# EAGLE design MotorDriver2_v0.6 (EAGLE 5.10)
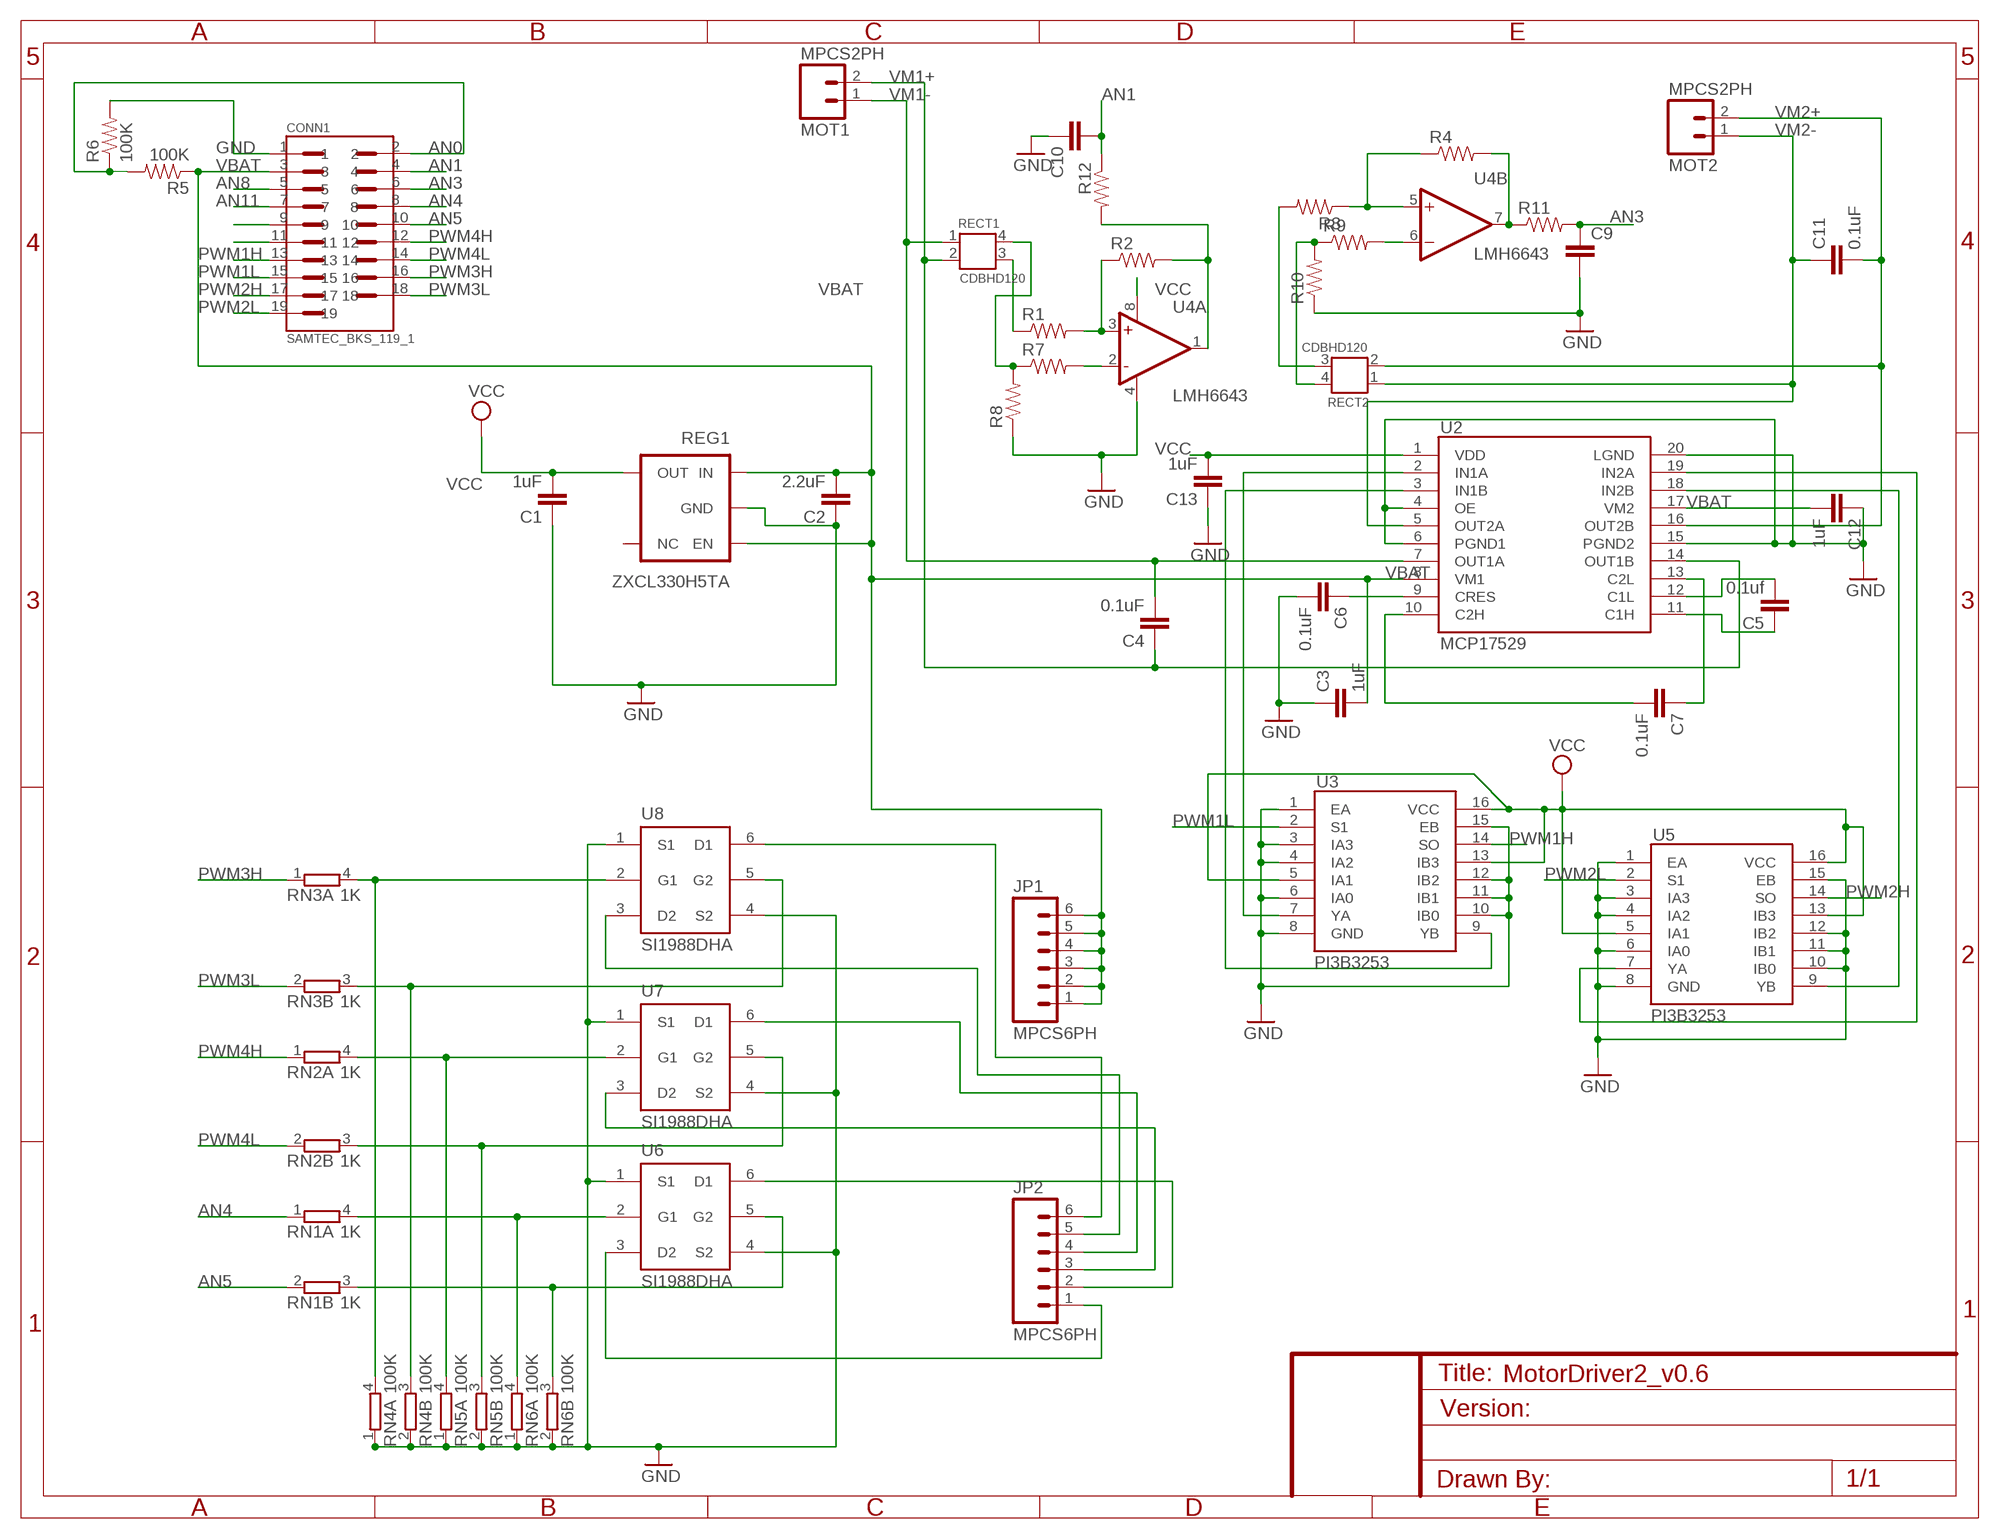
[diagram p0: schematic, sheet 1]

## Parts
C1  1uF  CAP0402-CAP  [0402-CAP]
C2  2.2uF  CAP0402-CAP  [0402-CAP]
C3  1uF  CAP0402-CAP  [0402-CAP]
C4  0.1uF  CAP0402-CAP  [0402-CAP]
C5  0.1uf  CAP0402-CAP  [0402-CAP]
C6  0.1uF  CAP0402-CAP  [0402-CAP]
C7  0.1uF  CAP0402-CAP  [0402-CAP]
C9  CAP0402-CAP  [0402-CAP]
C10  CAP0402-CAP  [0402-CAP]
C11  0.1uF  CAP0402-CAP  [0402-CAP]
C12  1uF  CAP0402-CAP  [0402-CAP]
C13  1uF  CAP0402-CAP  [0402-CAP]
CONN1  SAMTEC_BKS_119_1  [SAMTEC_19P_1MM_SOCKET]
JP1  MPCS6PH  [MOLEX-PICO_CLASP_S6P]
JP2  MPCS6PH  [MOLEX-PICO_CLASP_S6P]
MOT1  MPCS2PH  [MOLEX-PICO_CLASP_S2P]
MOT2  MPCS2PH  [MOLEX-PICO_CLASP_S2P]
R1  RESISTOR0402-RES  [0402-RES]
R2  RESISTOR0402-RES  [0402-RES]
R3  RESISTOR0402-RES  [0402-RES]
R4  RESISTOR0402-RES  [0402-RES]
R5  100K  RESISTOR0402-RES  [0402-RES]
R6  100K  RESISTOR0402-RES  [0402-RES]
R7  RESISTOR0402-RES  [0402-RES]
R8  RESISTOR0402-RES  [0402-RES]
R9  RESISTOR0402-RES  [0402-RES]
R10  RESISTOR0402-RES  [0402-RES]
R11  RESISTOR0402-RES  [0402-RES]
R12  RESISTOR0402-RES  [0402-RES]
RECT1  CDBHD120  [4-PIN_TO-269AA]
RECT2  CDBHD120  [4-PIN_TO-269AA]
REG1  ZXCL330H5TA  [SC-70-5]
RN1  1K  2R-NEXB24V  [EXB24V]
RN2  1K  2R-NEXB24V  [EXB24V]
RN3  1K  2R-NEXB24V  [EXB24V]
RN4  100K  2R-NEXB24V  [EXB24V]
RN5  100K  2R-NEXB24V  [EXB24V]
RN6  100K  2R-NEXB24V  [EXB24V]
U2  MCP17529  [20-T_VMFP]
U3  PI3B3253  [16-PIN_QSOP]
U4  LMH6643  [8-PIN_MSOP]
U5  PI3B3253  [16-PIN_QSOP]
U6  SI1988DHA  [SC-70-6]
U7  SI1988DHA  [SC-70-6]
U8  SI1988DHA  [SC-70-6]

## Nets
AN0 [Signal]: CONN1.2 R5.2 R6.1
AN1 [Signal]: C10.2 CONN1.4 R12.1
AN3 [Signal]: C9.1 CONN1.6 R11.2
AN4 [Signal]: CONN1.8 RN1.1
AN5 [Signal]: CONN1.10 RN1.2
AN8 [Signal]: CONN1.5
AN11 [Signal]: CONN1.7
GND [GND]: C1.1 C2.1 C3.1 C6.2 C9.2 C10.1 C12.1 C13.1 CONN1.1 R6.2 R8.1 R10.1 REG1.2(GND) RN4.1 RN4.2 RN5.1 RN5.2 RN6.1 RN6.2 U2.4(OE) U2.6(PGND1) U2.15(PGND2) U2.20(LGND) U3.1(EA) U3.3(IA3) U3.4(IA2) U3.6(IA0) U3.8(GND) U3.10(IB0) U3.11(IB1) U3.12(IB2) U3.15(EB) U4.4(A:VCC-) U5.1(EA) U5.3(IA3) U5.4(IA2) U5.6(IA0) U5.8(GND) U5.10(IB0) U5.11(IB1) U5.12(IB2) U5.15(EB) U6.1(S1) U6.4(S2) U7.1(S1) U7.4(S2) U8.1(S1) U8.4(S2)
N$3 [Signal]: U2.2(IN1A) U3.7(YA)
N$4 [Signal]: U2.3(IN1B) U3.9(YB)
N$5 [Signal]: C5.2 U2.12(C1L)
N$6 [Signal]: C5.1 U2.11(C1H)
N$7 [Signal]: R3.2 RECT2.3
N$8 [Signal]: C7.1 U2.13(C2L)
N$10 [Signal]: C7.2 U2.10(C2H)
N$11 [Signal]: C6.1 U2.9(CRES)
N$12 [Signal]: R1.2 R2.1 U4.3(A:+IN)
N$13 [Signal]: R2.2 R12.2 U4.1(A:OUT)
N$14 [Signal]: R3.1 R4.1 U4.5(B:+IN)
N$15 [Signal]: U2.19(IN2A) U5.7(YA)
N$16 [Signal]: U2.18(IN2B) U5.9(YB)
N$17 [Signal]: R4.2 R11.1 U4.7(B:OUT)
N$18 [Signal]: R9.1 R9.2 R10.2 RECT2.4 U4.6(B:-IN)
N$19 [Signal]: R7.2 U4.2(A:-IN)
N$21 [Signal]: JP2.6 U8.6(D1)
N$22 [Signal]: JP2.5 U8.3(D2)
N$23 [Signal]: JP2.4 U7.6(D1)
N$24 [Signal]: JP2.3 U7.3(D2)
N$25 [Signal]: JP2.2 U6.6(D1)
N$26 [Signal]: JP2.1 U6.3(D2)
N$27 [Signal]: RN1.3 RN6.3 U6.5(G2)
N$28 [Signal]: RN1.4 RN6.4 U6.2(G1)
N$29 [Signal]: RN2.3 RN5.3 U7.5(G2)
N$30 [Signal]: RN2.4 RN5.4 U7.2(G1)
N$31 [Signal]: R1.1 RECT1.3
N$32 [Signal]: RN3.4 RN4.4 U8.2(G1)
N$33 [Signal]: R7.1 R8.2 RECT1.4
N$50 [Signal]: RN3.3 RN4.3 U8.5(G2)
P9 [Signal]: CONN1.9
P11 [Signal]: CONN1.11
PWM1H [Signal]: CONN1.13 U3.14(SO)
PWM1L [Signal]: CONN1.15 U3.2(S1)
PWM2H [Signal]: CONN1.17 U5.14(SO)
PWM2L [Signal]: CONN1.19 U5.2(S1)
PWM3H [Signal]: CONN1.16 RN3.1
PWM3L [Signal]: CONN1.18 RN3.2
PWM4H [Signal]: CONN1.12 RN2.1
PWM4L [Signal]: CONN1.14 RN2.2
VBAT: C2.2 C3.2 C12.2 CONN1.3 JP1.1 JP1.2 JP1.3 JP1.4 JP1.5 JP1.6 R5.1 REG1.1(IN) REG1.3(EN) U2.8(VM1) U2.17(VM2)
VCC [VCC]: C1.2 C13.2 REG1.5(OUT) U2.1(VDD) U3.5(IA1) U3.13(IB3) U3.16(VCC) U4.8(A:VCC+) U5.5(IA1) U5.13(IB3) U5.16(VCC)
VM1+: C4.1 MOT1.2 RECT1.2 U2.14(OUT1B)
VM1-: C4.2 MOT1.1 RECT1.1 U2.7(OUT1A)
VM2+: C11.2 MOT2.2 RECT2.2 U2.16(OUT2B)
VM2-: C11.1 MOT2.1 RECT2.1 U2.5(OUT2A)
Unconnected: REG1.4(NC)

## Library data of the parts
C1-C7 C9-C13 = SparkFun:CAP: Capacitor Standard 0603 ceramic capacitor, and 0.1" leaded capacitor.
CONN1 = AMH:SAMTEC_BKS_119_1
JP1 JP2 = stan:MPCS6P: Molex Pico-Clasp Single Row 6 Pos
MOT1 MOT2 = stan:MPCS2P: Molex Pico-Clasp Single Row 2 POS
R1-R12 = SparkFun:RESISTOR: Resistor Basic schematic elements and footprints for 0603, 1206, and PTH 1/10th watt (small) resistors.
RECT1 RECT2 = AMH:CDBHD120
REG1 = stan:ZXCL330: Zetex ZXCL Series Voltage Regulator
RN1-RN6 = resistor-dil:2R-N: Array Chip Resistor Source: Panasonic
U2 = AMH:MCP17529
U3 U5 = AMH:PI3B3253
U4 = AMH:LMH6643
U6-U8 = stan:SI1988DH: 2 N-Channel MOSFET Package: SC-70-6

## Net classes
0 Power: width 0.305 mm, drill 0.254 mm, clearance 0.152 mm
1 Signal: width 0.152 mm, drill 0.254 mm, clearance 0.152 mm
2 GND: width 0.305 mm, drill 0.254 mm, clearance 0.152 mm
3 VCC: width 0.254 mm, drill 0.254 mm, clearance 0.152 mm

## Board
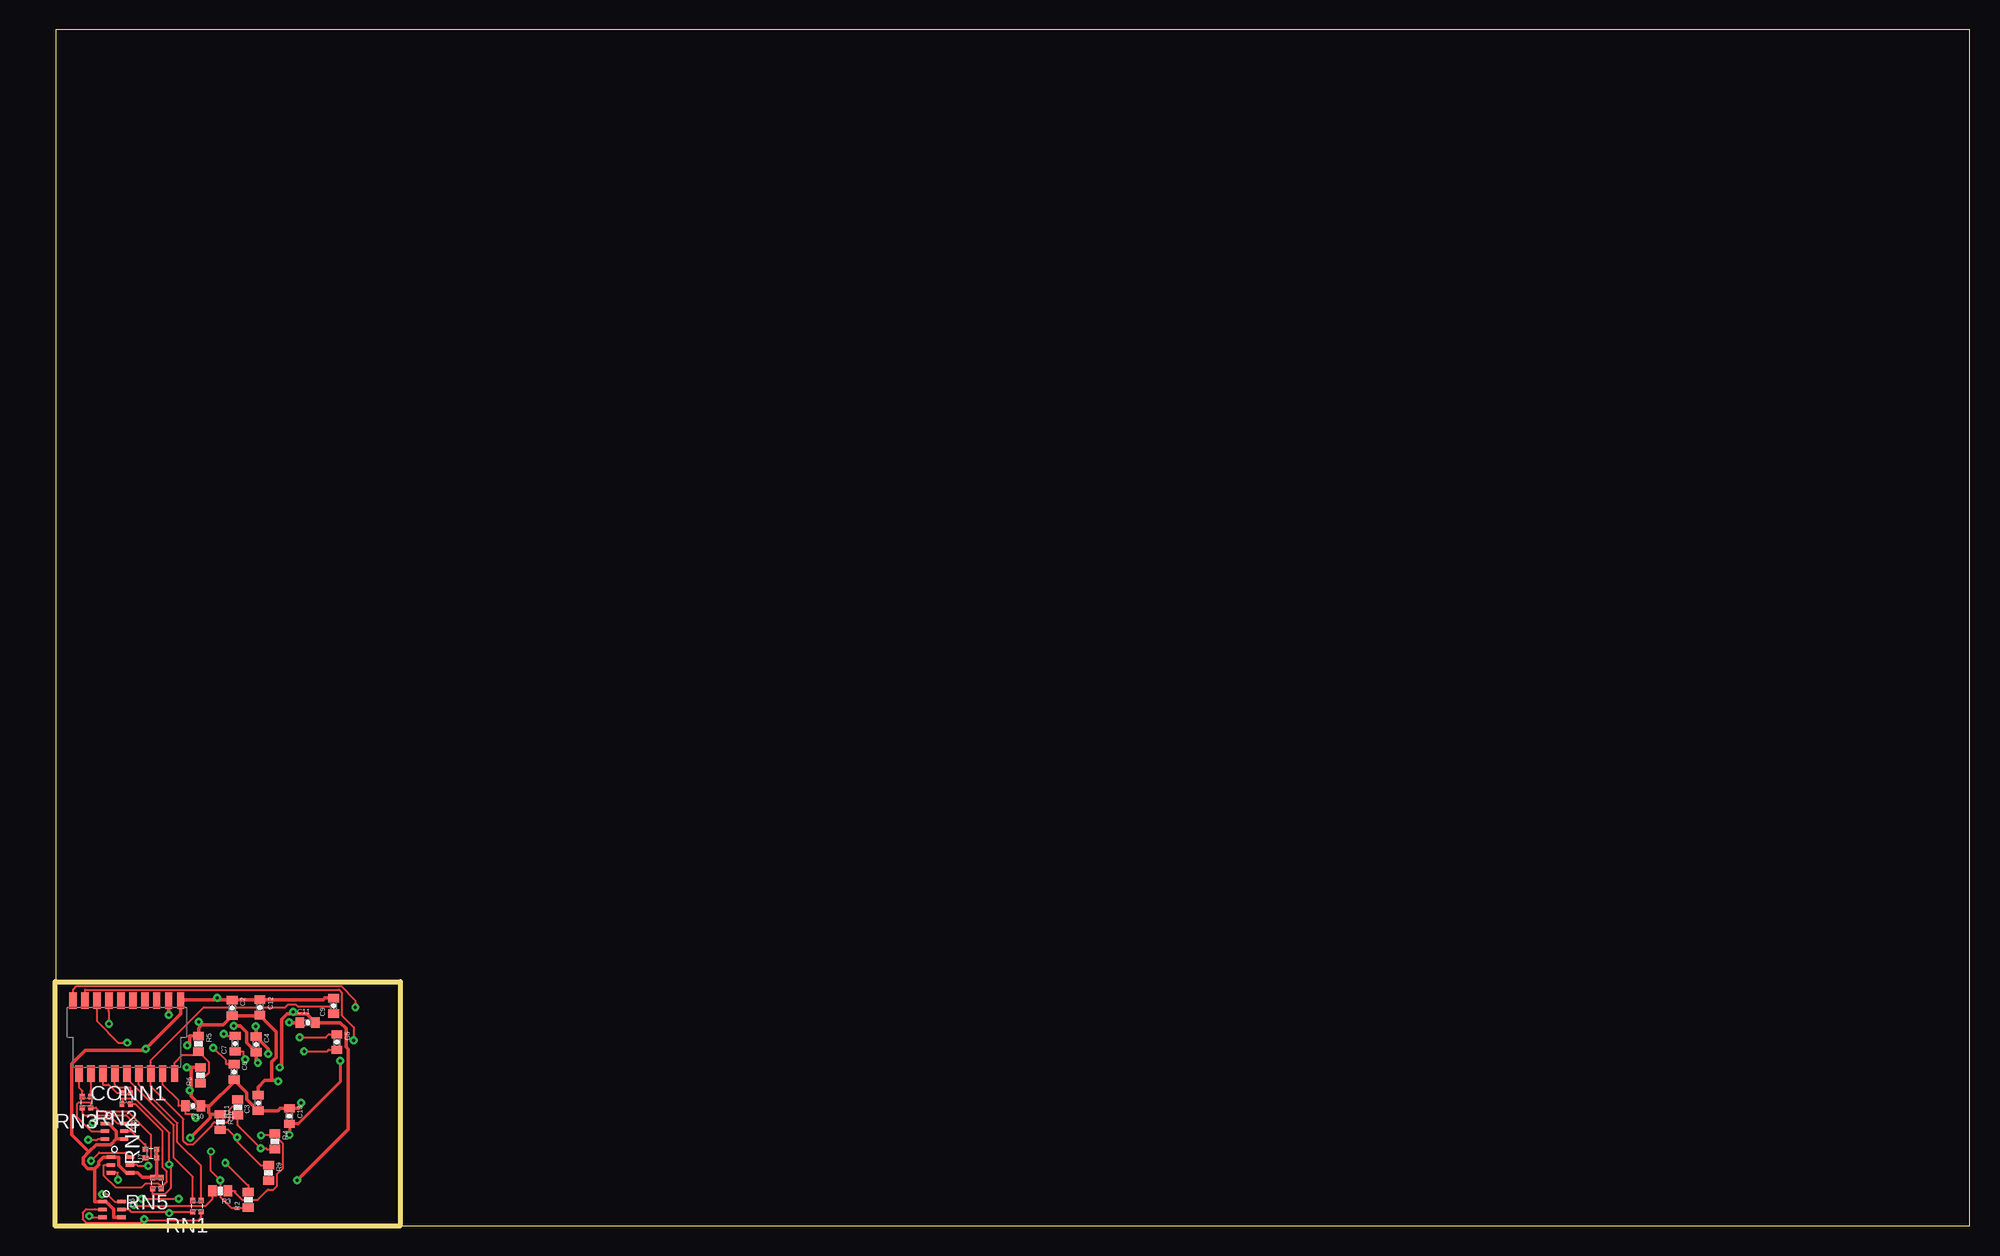
[diagram p1: board, top side]
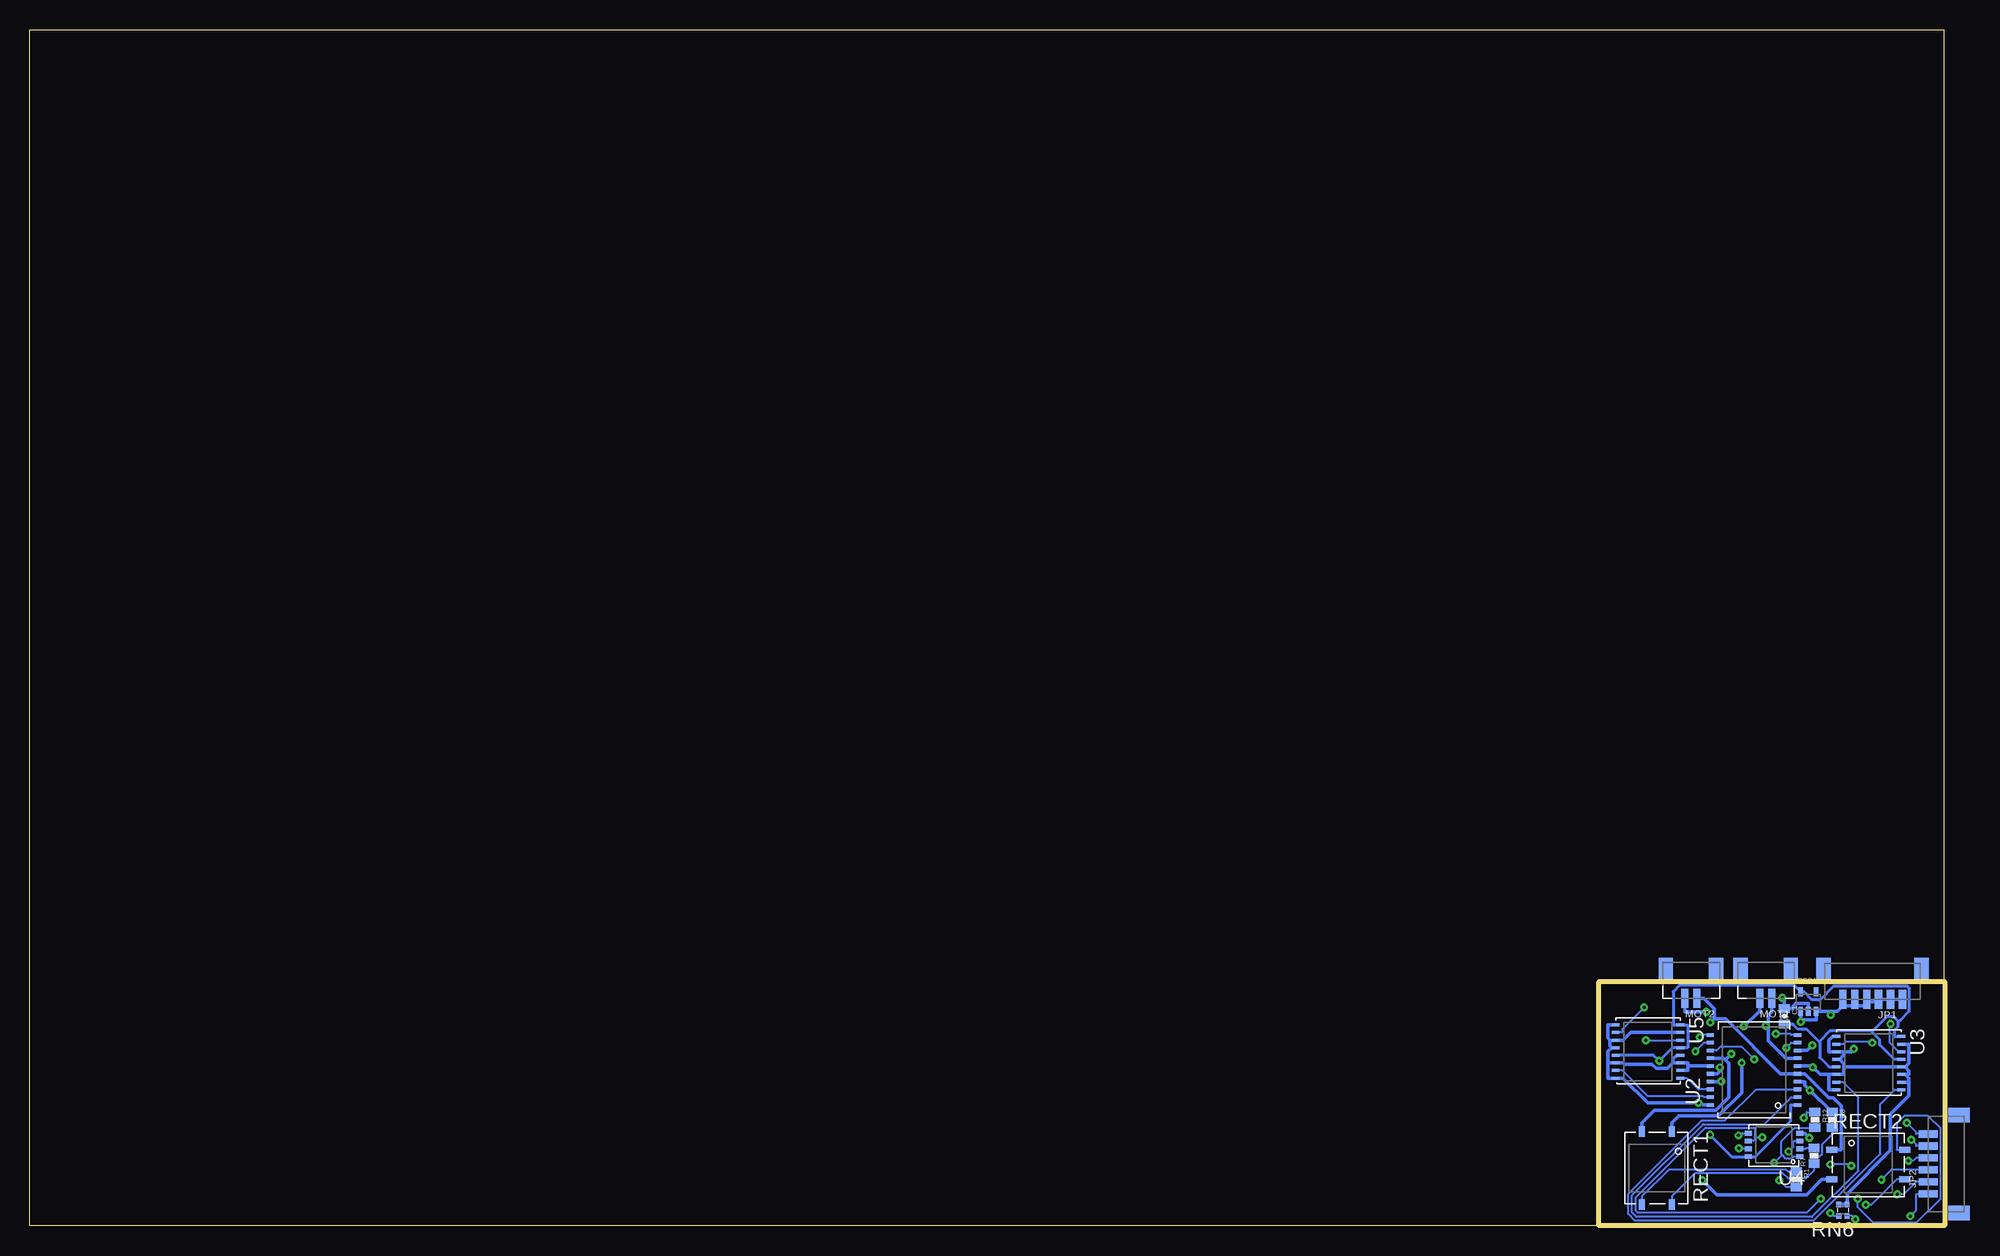
[diagram p2: board, bottom side, seen from below]

Size 160.1 x 100 mm. Coordinates in mm from the lower left corner, seen from the top.
Outline: 28.9,0 0.1,0 0.1,20.4
Outline: 28.9,0 160.1,0 160.1,100 0.1,100 0.1,20.4
Outline: 0.1,20.4 28.9,20.4 28.9,0
Outline: 0.1,20.4 0,20.4 0,0 28.9,0
Copper layers (1*16): Top 0.035mm / dielectric 1.5mm / Bottom 0.035mm
Design rules "default *": minimum track width 6mil, minimum drill 10mil, track to track 6mil, track to pad 6mil, pad to pad 6mil, via to via 6mil, smd to smd 6mil, copper to edge 0mil, drill to drill 6mil, minimum pad ring 10mil, minimum via ring 8mil, stop-mask expansion 4mil, vias tented up to drill 0mil, thermal gap 10mil

### Footprints (pad centres in the part's own frame; a part is rotated, then mirrored left to right if it is on the bottom)
0402-CAP = smd 0.7 x 0.9: 1 -0.65,0; 2 0.65,0
SAMTEC_19P_1MM_SOCKET = smd 0.61 x 1.375: 1 -4,-3.05; 2 -3.5,3.05; 3 -3,-3.05; 4 -2.5,3.05; 5 -2,-3.05; 6 -1.5,3.05; 7 -1,-3.05; 8 -0.5,3.05; 9 0,-3.05; 10 0.5,3.05; 11 1,-3.05; 12 1.5,3.05; 13 2,-3.05; 14 2.5,3.05; 15 3,-3.05; 16 3.5,3.05; 17 4,-3.05; 18 4.5,3.05; 19 5,-3.05
MOLEX-PICO_CLASP_S6P = smd 0.6 x 1.6: 1 -2.5,1; 2 -1.5,1; 3 -0.5,1; 4 0.5,1; 5 1.5,1; 6 2.5,1 | smd 1.2 x 1.8: A -4.1,-1.55; B 4.1,-1.55
MOLEX-PICO_CLASP_S2P = smd 0.6 x 1.6: 1 -0.5,1; 2 0.5,1 | smd 1.2 x 1.8: A -2.1,-1.5; B 2.1,-1.5
0402-RES = smd 0.7 x 0.9: 1 -0.65,0; 2 0.65,0
4-PIN_TO-269AA = smd 0.9 x 0.5: 1 -3.05,1.25; 2 -3.05,-1.25; 3 3.05,-1.25; 4 3.05,1.25
SC-70-5 = smd 0.4 x 0.75: 1 -0.65,-0.825; 2 0,-0.825; 3 0.65,-0.825; 4 0.65,0.825; 5 -0.65,0.825
EXB24V = smd 0.4 x 0.45: 1 -0.35,-0.475; 2 0.35,-0.475; 3 0.35,0.475; 4 -0.35,0.475
20-T_VMFP = smd 0.3 x 0.6: 1 -2.925,-3.65; 2 -2.275,-3.65; 3 -1.625,-3.65; 4 -0.975,-3.65; 5 -0.325,-3.65; 6 0.325,-3.65; 7 0.975,-3.65; 8 1.625,-3.65; 9 2.275,-3.65; 10 2.925,-3.65; 11 2.925,3.65; 12 2.275,3.65; 13 1.625,3.65; 14 0.975,3.65; 15 0.325,3.65; 16 -0.325,3.65; 17 -0.975,3.65; 18 -1.625,3.65; 19 -2.275,3.65; 20 -2.925,3.65
16-PIN_QSOP = smd 0.25 x 0.65: 1 -2.223,-2.715; 2 -1.587,-2.715; 3 -0.953,-2.715; 4 -0.318,-2.715; 5 0.318,-2.715; 6 0.953,-2.715; 7 1.587,-2.715; 8 2.223,-2.715; 9 2.223,2.715; 10 1.587,2.715; 11 0.953,2.715; 12 0.318,2.715; 13 -0.318,2.715; 14 -0.953,2.715; 15 -1.587,2.715; 16 -2.223,2.715
8-PIN_MSOP = smd 0.6 x 0.41: 1 -2.15,0.975; 2 -2.15,0.325; 3 -2.15,-0.325; 4 -2.15,-0.975; 5 2.15,-0.975; 6 2.15,-0.325; 7 2.15,0.325; 8 2.15,0.975
SC-70-6 = smd 0.3 x 0.7: 1 -0.65,-0.8; 2 0,-0.8; 3 0.65,-0.8; 4 0.65,0.8; 5 0,0.8; 6 -0.65,0.8

### Placement (x,y rotation side)
C1  13.42,17.51 270 bottom
C2  14.84,18.22 270 top
C3  17,10.27 90 top
C4  16.84,15.16 270 top
C5  23.59,15.36 270 top
C6  15,12.86 270 top
C7  15.08,15.23 90 top
C9  23.32,18.4 90 top
C10  11.57,10.02 180 top
C11  21.15,16.98 0 top
C12  17.16,18.26 270 top
C13  19.62,9.17 270 top
CONN1  6.53,15.77 180 top
JP1  6.03,19.93 180 bottom
JP2  0.37,5.17 90 bottom
MOT1  14.97,20.01 180 bottom
MOT2  21.22,20.01 180 bottom
R1  12.42,3.88 270 bottom
R2  16.18,2.17 90 top
R3  13.84,2.92 180 top
R4  18.4,7.05 270 top
R5  12.02,15.22 270 top
R6  12.18,12.59 90 top
R7  10.92,5.86 90 bottom
R8  9.4,8.87 270 bottom
R9  17.88,4.42 270 top
R10  13.84,8.67 270 top
R11  15.3,9.9 90 top
R12  10.86,8.85 270 bottom
RECT1  24.06,4.82 270 bottom
RECT2  6.39,5.12 0 bottom
REG1  11.4,18.74 0 bottom
RN1  11.89,1.64 180 top
RN2  5.97,10.64 180 top
RN3  2.65,10.34 180 top
RN4  8.05,6.04 90 top
RN5  8.54,3.57 180 top
RN6  8.51,1.3 180 bottom
U2  15.95,13.03 90 bottom
U3  6.34,13.6 270 bottom
U4  14.28,6.76 180 bottom
U5  24.81,14.57 270 bottom
U6  4.79,1.36 270 top
U7  5.49,5.08 270 top
U8  5.01,7.91 270 top

### Tracks (layer width: path | path; a pad name or v marks a point on that pad's centre or on a via)
AN0
  Top 0.152: R6.1 12.18,12.52 12.61,12.52 12.86,12.76 12.86,13.73 12.3,14.28 12.02,14.28 | CONN1.2 10.03,13.64 10.67,14.28 12.02,14.28 | 12.02,14.28 R5.2
AN1  (via drill 0.25 pad 0.66)
  Top 0.152: v11.8,9.03 11.49,9.34 10.92,9.34 C10.2 10.34,10.02 10.34,10.49 9.03,11.8 CONN1.4
  Bottom 0.152: v11.8,9.03 11.54,9.29 11.54,9.5 R12.1
AN3
  Top 0.152: R11.2 15.3,9.97 14.87,9.97 14.62,9.73 14.62,8.88 14.4,8.67 13.35,8.67 13.16,8.48 13.16,8.39 11.56,6.79 11.06,6.79 10.75,7.1 10.75,8.92 8.03,11.64 CONN1.6 8.03,13.64 8.03,13.85 12.45,18.27 19.27,18.27 19.5,18.5 20.15,18.5 20.32,18.33 23.32,18.33 C9.1
AN4
  Top 0.152: RN1.1 12.24,2.57 12.24,5.01 10.26,7 10.26,8.58 7.03,11.8 CONN1.8
AN5
  Top 0.152: RN1.2 11.54,4.09 9.95,5.68 9.95,8.42 6.03,12.34 CONN1.10
GND  (via drill 0.25 pad 0.66)
  Top 0.305: 11.42,11.33 11.42,10.81 C10.1 12.88,10.02 | 11.42,13.24 11.42,11.33 | 11.42,11.33 v11.27,11.33 | 2.85,6.16 1.42,7.59 1.42,13.54 2.56,14.68 7.47,14.68 v7.59,14.79 10.53,17.73 CONN1.1 10.58,18.87 13.58,18.87 | 2.85,6.16 3.47,6.78 4.68,6.78 5.15,7.26 | 3.33,4.77 2.77,4.77 2.36,5.18 2.36,5.67 2.85,6.16 | 12.98,9.32 12.98,9.02 v11.31,7.36 | 12.88,10.02 12.88,9.43 12.98,9.32 | 12.98,9.32 13.08,9.32 R10.1 | 3.33,4.77 3.67,5.1 3.67,5.36 4.04,5.73 U7.1 5.34,5.73 5.34,5.06 5.97,4.43 U7.4 6.94,4.43 7.33,4.04 RN5.2 8.53,4.04 | 3.33,4.77 3.33,2.01 U6.1 4.29,2.01 4.93,1.37 4.93,0.71 U6.4 | 13.58,18.87 v13.58,19.06 | 13.58,18.87 C2.1 15.59,18.87 15.63,18.91 C12.1 17.92,18.91 22.43,18.91 22.57,19.05 C9.2 | v11.02,13.26 11.4,13.26 11.42,13.24 | RN4.2 RN4.1 8.53,5.18 8.53,4.04 | 15,12.05 15.11,12.05 16.05,11.1 16.05,10.56 C3.1 17.76,9.62 18.67,9.62 18.87,9.82 19.43,9.82 C13.1 20.38,9.82 20.6,10.04 v20.6,10.28 | 12.88,10.02 12.97,10.02 15,12.05 | 11.42,13.24 R6.2 | 5.15,7.26 U8.4 | 5.15,7.26 5.15,7.9 4.49,8.56 U8.1 | 15,12.05 C6.2 | 8.53,4.04 RN5.1
  Bottom 0.305: 9.69,12.65 9.69,11.38 U3.8 | 9.69,12.65 10.4,12.65 v11.02,13.26 11.11,13.36 11.7,13.36 U2.6 | R8.1 9.46,9.52 v11.27,11.33 11.7,11.76 11.7,12.05 U2.4 | 8.42,14.55 7.83,14.55 v7.59,14.79 | 8.79,13.92 8.42,14.28 8.42,14.55 | v11.31,7.36 11.69,7.74 U4.4 | 3,12.01 3,10.87 4.54,9.33 4.54,6.31 8.16,2.69 8.16,2.04 | 3.31,12.65 3,12.33 3,12.01 | 3.31,13.28 3,13.6 3,15.19 U3.15 | 3.31,13.28 3,12.97 3,12.65 3.31,12.65 | 8.42,14.55 U3.3 9.69,14.55 9.69,15.51 9.37,15.82 U3.1 | v13.58,19.06 13.58,18.97 13.42,18.82 C1.1 12.66,18.16 12.66,18.38 12.45,18.59 11.4,18.59 REG1.2 | 3,12.01 U3.10 | 3.31,12.65 U3.11 | 3.31,13.28 U3.12 4.25,13.28 8.42,13.28 | 8.42,13.28 8.42,13.55 8.79,13.92 | 8.42,13.28 8.42,12.65 U3.6 9.23,12.65 9.69,12.65 | 8.79,13.92 U3.4 | 22.73,13.62 23.2,13.14 24.13,13.14 24.51,13.52 | 24.51,13.52 | 24.51,13.52 26.79,13.52 26.9,13.62 U5.6 28.16,13.62 | 22.73,13.62 22.73,13.94 22.41,14.25 U5.12 | 22.73,13.62 U5.11 21.46,13.62 21.46,13.36 | 27.84,14.89 28.16,14.57 28.16,13.62 | 28.16,13.62 28.16,12.35 U5.8 26.9,12.35 24.83,10.28 v20.6,10.28 20.38,10.28 20.21,10.11 U2.20 | 21.46,13.36 21.46,12.98 U5.10 | 21.46,13.36 20.21,13.36 U2.15 | U5.15 22.3,16.16 22.73,16.16 26.26,16.16 26.9,15.52 U5.3 27.98,15.52 | 27.84,14.89 27.98,15.03 27.98,15.52 | U5.1 28.16,16.79 28.16,15.69 27.98,15.52 | RN6.2 8.36,1.77 8.36,1.84 8.16,2.04 | 8.16,2.04 RN6.1 | 27.84,14.89 U5.4
N$3
  Bottom 0.152: U3.7 8.5,12.01 7.22,10.73 7.22,4.61 11.09,0.74 25.78,0.74 26.16,1.12 26.16,2.53 20.19,8.5 15.08,8.5 12.83,10.76 U2.2
N$4
  Bottom 0.152: U2.3 15.77,11.4 18.37,8.8 20.32,8.8 26.46,2.66 26.46,0.99 25.91,0.43 10.97,0.43 | 10.97,0.43 | 5.39,6.02 10.97,0.43 | 5.39,6.02 | 5.39,6.02 5.39,10.17 4.18,11.38 U3.9
N$5  (via drill 0.25 pad 0.66)
  Top 0.152: C5.2 22.91,14.71 22.8,14.6 v20.84,14.6
  Bottom 0.152: U2.12 20.13,15.3 v20.84,14.6
N$6  (via drill 0.25 pad 0.66)
  Top 0.152: C5.1 22.91,16.01 22.66,15.75 v20.49,15.75
  Bottom 0.152: U2.11 20.29,15.96 v20.49,15.75
N$7  (via drill 0.25 pad 0.66)
  Top 0.152: v6.6,1.74 6.69,1.65 12.6,1.65 13.19,2.24 R3.2
  Bottom 0.152: v6.6,1.74 6.15,1.74 4.02,3.87 RECT2.3
N$8  (via drill 0.25 pad 0.66)
  Top 0.152: v15.93,13.91 15.76,14.09 15.76,14.58 C7.1
  Bottom 0.152: U2.13 19.07,14.65 18.77,14.95 16.98,14.95 v15.93,13.91
N$10  (via drill 0.25 pad 0.66)
  Top 0.152: C7.2 14.4,15.88 14.23,16.05 v14.11,16.05
  Bottom 0.152: U2.10 12.83,15.96 12.92,16.05 v14.11,16.05
N$11  (via drill 0.25 pad 0.66)
  Top 0.152: v13.26,14.87 14.32,13.81 14.32,13.51 C6.1
  Bottom 0.152: v13.26,14.87 12.83,15.3 U2.9
N$12  (via drill 0.25 pad 0.66)
  Top 0.152: v13.06,6.2 13.06,4.59 v13.84,3.81 13.84,2.42 14.74,1.52 R2.1
  Bottom 0.152: v13.06,6.2 12.66,6.6 12.66,7.08 U4.3 | v13.84,3.81 13.25,3.23 R1.2
N$13  (via drill 0.25 pad 0.66)
  Top 0.152: v14.27,5.25 16.12,3.4 16.18,3.4 R2.2
  Bottom 0.152: 13.59,5.93 v14.27,5.25 | 13.59,5.93 13.29,5.62 12.83,5.62 12.66,5.79 U4.1 | 13.59,5.93 13.67,6 13.67,7.04 12.52,8.2 R12.2
N$14  (via drill 0.25 pad 0.66)
  Top 0.152: 18.36,7.58 19.08,6.87 19.08,4.82 18.59,4.33 18.59,3.33 18.28,3.01 17.82,3.01 16.99,2.18 15.66,2.18 15.07,2.77 15.07,2.92 R3.1 | 18.36,7.58 18.32,7.54 v17.24,7.54 | R4.1 18.4,7.62 18.36,7.58
  Bottom 0.152: v17.24,7.54 17.15,7.54 16.96,7.74 U4.5
N$15
  Bottom 0.152: U2.19 20.13,10.76 20.21,10.84 24.83,10.84 26.97,12.98 U5.7
N$16
  Bottom 0.152: U5.9 21.54,12.35 20.6,11.4 U2.18
N$17  (via drill 0.25 pad 0.66)
  Top 0.152: R11.1 15.3,8.4 v17.22,6.49 17.64,6.49 17.72,6.4 R4.2
  Bottom 0.152: U4.7 17.17,6.43 v17.22,6.49
N$18  (via drill 0.25 pad 0.66)
  Top 0.152: v7.27,2.26 v10.37,2.26 | R10.2 14.52,8.02 15.14,7.4 v15.25,7.4 15.25,7.02 17.2,5.07 R9.1 R9.2
  Bottom 0.152: 15.9,7.4 15.9,8.12 15.97,8.19 20,8.19 25.81,2.38 25.81,1.24 25.66,1.09 11.54,1.09 v10.37,2.26 | 15.9,7.4 15.9,7.17 15.98,7.08 U4.6 | 15.9,7.4 v15.25,7.4 | v7.27,2.26 7.27,1.54 5.97,0.24 2.38,0.24 0.34,2.27 0.34,8.13 1.4,9.18 3.37,9.18 4.02,8.54 4.02,6.37 RECT2.4
N$19
  Bottom 0.152: U4.2 11.6,6.43 11.6,6.51 R7.2
N$21  (via drill 0.25 pad 0.66)
  Top 0.152: U8.6 5.23,8.56 4.85,8.94 3.52,8.94 v3.17,8.59
  Bottom 0.152: JP2.6 2.4,7.67 2.4,7.82 v3.17,8.59
N$22  (via drill 0.25 pad 0.66)
  Top 0.152: U8.3 3.63,7.26 3.54,7.17 v2.78,7.17
  Bottom 0.152: JP2.5 2.4,6.67 2.4,6.79 v2.78,7.17
N$23  (via drill 0.25 pad 0.66)
  Top 0.152: U7.6 5.91,6.11 3.71,6.11 v3.03,5.43
  Bottom 0.152: JP2.4 2.4,5.67 2.64,5.43 v3.03,5.43
N$24  (via drill 0.25 pad 0.66)
  Top 0.152: v5.29,3.83 5.27,3.85 5.27,4.43 U7.3
  Bottom 0.152: JP2.3 4.45,4.67 v5.29,3.83
N$25  (via drill 0.25 pad 0.66)
  Top 0.152: v3.98,2.65 4.37,2.65 5.01,2.01 U6.6
  Bottom 0.152: v3.98,2.65 3.42,2.65 2.4,3.67 JP2.2
N$26  (via drill 0.25 pad 0.66)
  Top 0.152: U6.3 2.99,0.71 v2.89,0.81
  Bottom 0.152: JP2.1 2.4,2.67 2.4,1.3 v2.89,0.81
N$27  (via drill 0.25 pad 0.66)
  Top 0.152: 9.55,1.17 6.36,1.17 6.17,1.36 U6.5 | 9.55,1.17 RN1.3 | 9.55,1.17 v9.55,1.06
  Bottom 0.152: RN6.3 9.29,0.82 9.52,1.06 v9.55,1.06
N$28  (via drill 0.25 pad 0.66)
  Top 0.152: RN1.4 12.24,0.71 12,0.47 7.52,0.47 v7.46,0.53 7.17,0.24 2.62,0.24 2.33,0.53 2.33,1.1 2.62,1.39 3.38,1.39 3.41,1.36 U6.2
  Bottom 0.152: RN6.4 7.73,0.82 7.73,0.8 v7.46,0.53
N$29  (via drill 0.25 pad 0.66)
  Top 0.152: U7.5 6.87,5.08 6.95,5 v7.81,5 | RN2.3 5.62,10.62 6.73,10.62 9.58,7.77 v9.58,5.12 9.69,5.01 9.69,3.14 9.19,2.64 8.19,2.64 RN5.3
  Bottom 0.152: v9.58,5.12 7.93,5.12 v7.81,5
N$30
  Top 0.152: 8.89,3.32 9,3.32 9.37,3.69 9.37,4.54 9.02,4.89 9.02,7.89 6.75,10.16 RN2.4 | U7.2 4.11,5.08 4.11,4.18 5.08,3.21 7.26,3.21 7.6,3.55 8.66,3.55 8.89,3.32 | 8.89,3.32 RN5.4
N$31
  Bottom 0.152: R1.1 13.1,4.53 13.25,4.68 23.08,4.68 25.31,2.45 RECT1.3
N$32
  Top 0.152: U8.2 3.03,7.91 1.87,9.07 1.87,10.18 2,10.32 3,10.32 RN3.4 3.43,9.87 3.73,9.56 6.08,9.56 8.03,7.62 8.03,5.69 RN4.4
N$33
  Bottom 0.152: RECT1.4 22.81,2.45 20.89,4.37 13.52,4.37 13.1,3.95 11.6,3.95 10.92,4.63 R7.1 10.92,5.79 10.49,5.79 10.24,6.03 10.24,6.8 9.4,7.64 R8.2
N$50
  Top 0.152: RN3.3 2.3,9.41 2.46,9.25 5.96,9.25 6.4,8.81 6.4,8.07 6.24,7.91 | 6.24,7.91 6.39,7.91 7.48,6.82 7.57,6.82 RN4.3 | 6.24,7.91 U8.5
PWM1H  (via drill 0.25 pad 0.66)
  Top 0.152: CONN1.13 4.53,17.9 v4.53,16.89
  Bottom 0.152: U3.14 3.85,14.55 4.58,15.29 4.58,16.84 v4.53,16.89
PWM1L  (via drill 0.25 pad 0.66)
  Top 0.152: CONN1.15 3.53,17.1 5.32,15.31 v6.05,15.31
  Bottom 0.152: U3.2 8.5,15.19 8.3,15.39 6.12,15.39 v6.05,15.31
PWM2H  (via drill 0.25 pad 0.66)
  Top 0.152: v24.99,15.52 24.99,16.6 24,17.59 24,19.5 23.76,19.74 2.53,19.74 CONN1.17
  Bottom 0.152: v24.99,15.52 22.65,15.52 U5.14
PWM2L  (via drill 0.25 pad 0.66)
  Top 0.152: CONN1.19 1.53,19.74 1.84,20.04 23.94,20.04 25.14,18.84 v25.14,18.27
  Bottom 0.152: U5.2 26.97,16.16 26.97,16.44 v25.14,18.27
PWM3H
  Top 0.152: RN3.1 3,11.27 3.03,11.3 CONN1.16
PWM3L
  Top 0.152: RN3.2 2.3,11.27 2.03,11.54 CONN1.18
PWM4H
  Top 0.152: CONN1.12 5.03,11.8 5.26,11.57 6.32,11.57 RN2.1
PWM4L
  Top 0.152: CONN1.14 4.03,11.8 4.5,11.8 5.19,11.12 RN2.2
VBAT  (via drill 0.25 pad 0.66)
  Top 0.305: 17.16,17.57 C12.2 | 18.14,12.14 18.14,13.71 18.51,14.07 18.51,16.22 17.16,17.57 | 17.16,17.57 15.59,17.57 C2.2 14.06,16.79 12.29,16.79 | 18.14,12.14 17.57,12.14 17,11.57 C3.2 | v18.69,12.07 18.63,12.14 18.14,12.14 | v12.02,17.05 12.29,16.79 | 12.29,16.79 | 12.29,16.79 12.02,16.52 R5.1 11.26,15.87 11.26,15.29 v11.06,15.09 | v9.53,17.63 9.53,17.83 CONN1.3
  Bottom 0.305: 12.02,17.23 12.05,17.23 REG1.1 | 12.02,17.23 10.75,17.23 REG1.3 9.53,17.91 | 12.02,17.23 v12.02,17.05 | U2.8 11.5,14.65 v11.06,15.09 | JP1.1 JP1.2 JP1.3 5.76,18.7 6.53,18.7 | 6.53,18.7 6.53,18.47 6.63,18.38 7.53,18.38 | 6.53,18.7 JP1.4 | 9.53,17.91 8.99,17.91 8.53,18.38 | 9.53,17.91 v9.53,17.63 | 8.53,18.38 JP1.6 | v18.69,12.07 18.71,12.05 19,12.05 U2.17 | 7.53,18.38 8.53,18.38 | 7.53,18.38 JP1.5
VCC  (via drill 0.25 pad 0.66)
  Top 0.254: v19.62,7.6 C13.2 20.35,8.52 23.87,12.04 v23.87,13.78
  Bottom 0.254: v19.62,7.6 17.8,5.79 U4.8 15.85,5.79 12.88,8.76 12.88,10.11 U2.1 | 6.08,16.21 5.44,15.56 5.44,15.13 4.23,13.92 U3.13 | 10.5,15.39 9.6,16.29 6.17,16.29 6.08,16.21 | 6.08,16.21 4.79,17.5 4.28,17.5 3.92,17.14 | 3.92,17.14 3.92,16.64 4.23,16.33 4.23,15.82 U3.16 | 3.92,17.14 3.76,17.14 2.95,17.96 2.95,19.84 3.13,20.02 9.3,20.02 10.42,18.91 11.1,18.91 11.76,19.57 REG1.5 12.57,20.09 22.18,20.09 22.7,19.57 22.7,16.79 U5.16 22.02,16.79 21.49,16.79 21.49,14.89 U5.13 22.76,14.89 v23.87,13.78 24.34,14.25 U5.5 | 10.5,15.39 10.45,15.35 10.45,14.08 9.66,13.28 U3.5 | 10.5,15.39 11.55,16.44 12.28,16.44 12.69,16.86 C1.2
VM1+  (via drill 0.25 pad 0.66)
  Top 0.305: v16.79,16.66 16.79,16.52 16.84,16.46 C4.1 17.84,14.81 v17.84,14.39
  Bottom 0.305: 18.36,13.87 18.05,13.56 18.05,10.74 19.15,9.64 24.29,9.64 25.31,8.62 RECT1.2 | v16.79,16.66 15.55,17.91 15.47,17.91 MOT1.2 | 18.36,13.87 18.5,14.01 19,14.01 U2.14 | 18.36,13.87 v17.84,14.39
VM1-  (via drill 0.25 pad 0.66)
  Top 0.305: v16.98,13.62 16.98,13.71 16.84,13.86 C4.2 16.06,15.29 16.06,16.17 15.51,16.73 v14.96,16.73
  Bottom 0.305: v16.98,13.62 16.98,11.13 18.93,9.19 22.25,9.19 22.81,8.62 RECT1.1 | 14.75,16.73 v14.96,16.73 | 14.75,16.73 14.75,17.63 14.47,17.91 MOT1.1 | 14.75,16.73 14.75,15.45 13.31,14.01 12.9,14.01 U2.7
VM2+  (via drill 0.25 pad 0.66)
  Top 0.305: v18.81,13.23 18.97,13.39 18.97,17.26 19.44,17.73 19.92,17.73 | 19.92,17.73 v19.92,17.89 | 19.92,17.73 21.05,17.73 C11.2 23.87,16.98 24.35,16.5 24.35,14.95 24.54,14.76 24.54,8.07 v20.25,3.79
  Bottom 0.305: v18.81,13.23 18.81,12.89 19,12.71 U2.16 | v19.92,17.89 19.94,17.91 21.72,17.91 MOT2.2 | RECT2.2 10.26,3.87 11.55,2.58 19.04,2.58 v20.25,3.79
VM2-  (via drill 0.25 pad 0.66)
  Top 0.305: C11.1 19.85,16.98 19.83,17 v19.6,17
  Bottom 0.305: RECT2.1 8.69,6.37 8.64,6.41 8.64,10.04 9.31,10.71 9.7,10.71 11.7,12.71 U2.5 13.73,12.71 18.32,17.29 19.25,17.29 | 19.25,17.29 19.31,17.29 v19.6,17 | 19.25,17.29 19.25,18.12 20.14,19.01 MOT2.1